# EAGLE design Adafruit PMSA003I (EAGLE 9.6.2)
COMPANY: ADAFRUIT INDUSTRIES; DRAWN: KTOWN; REV: A
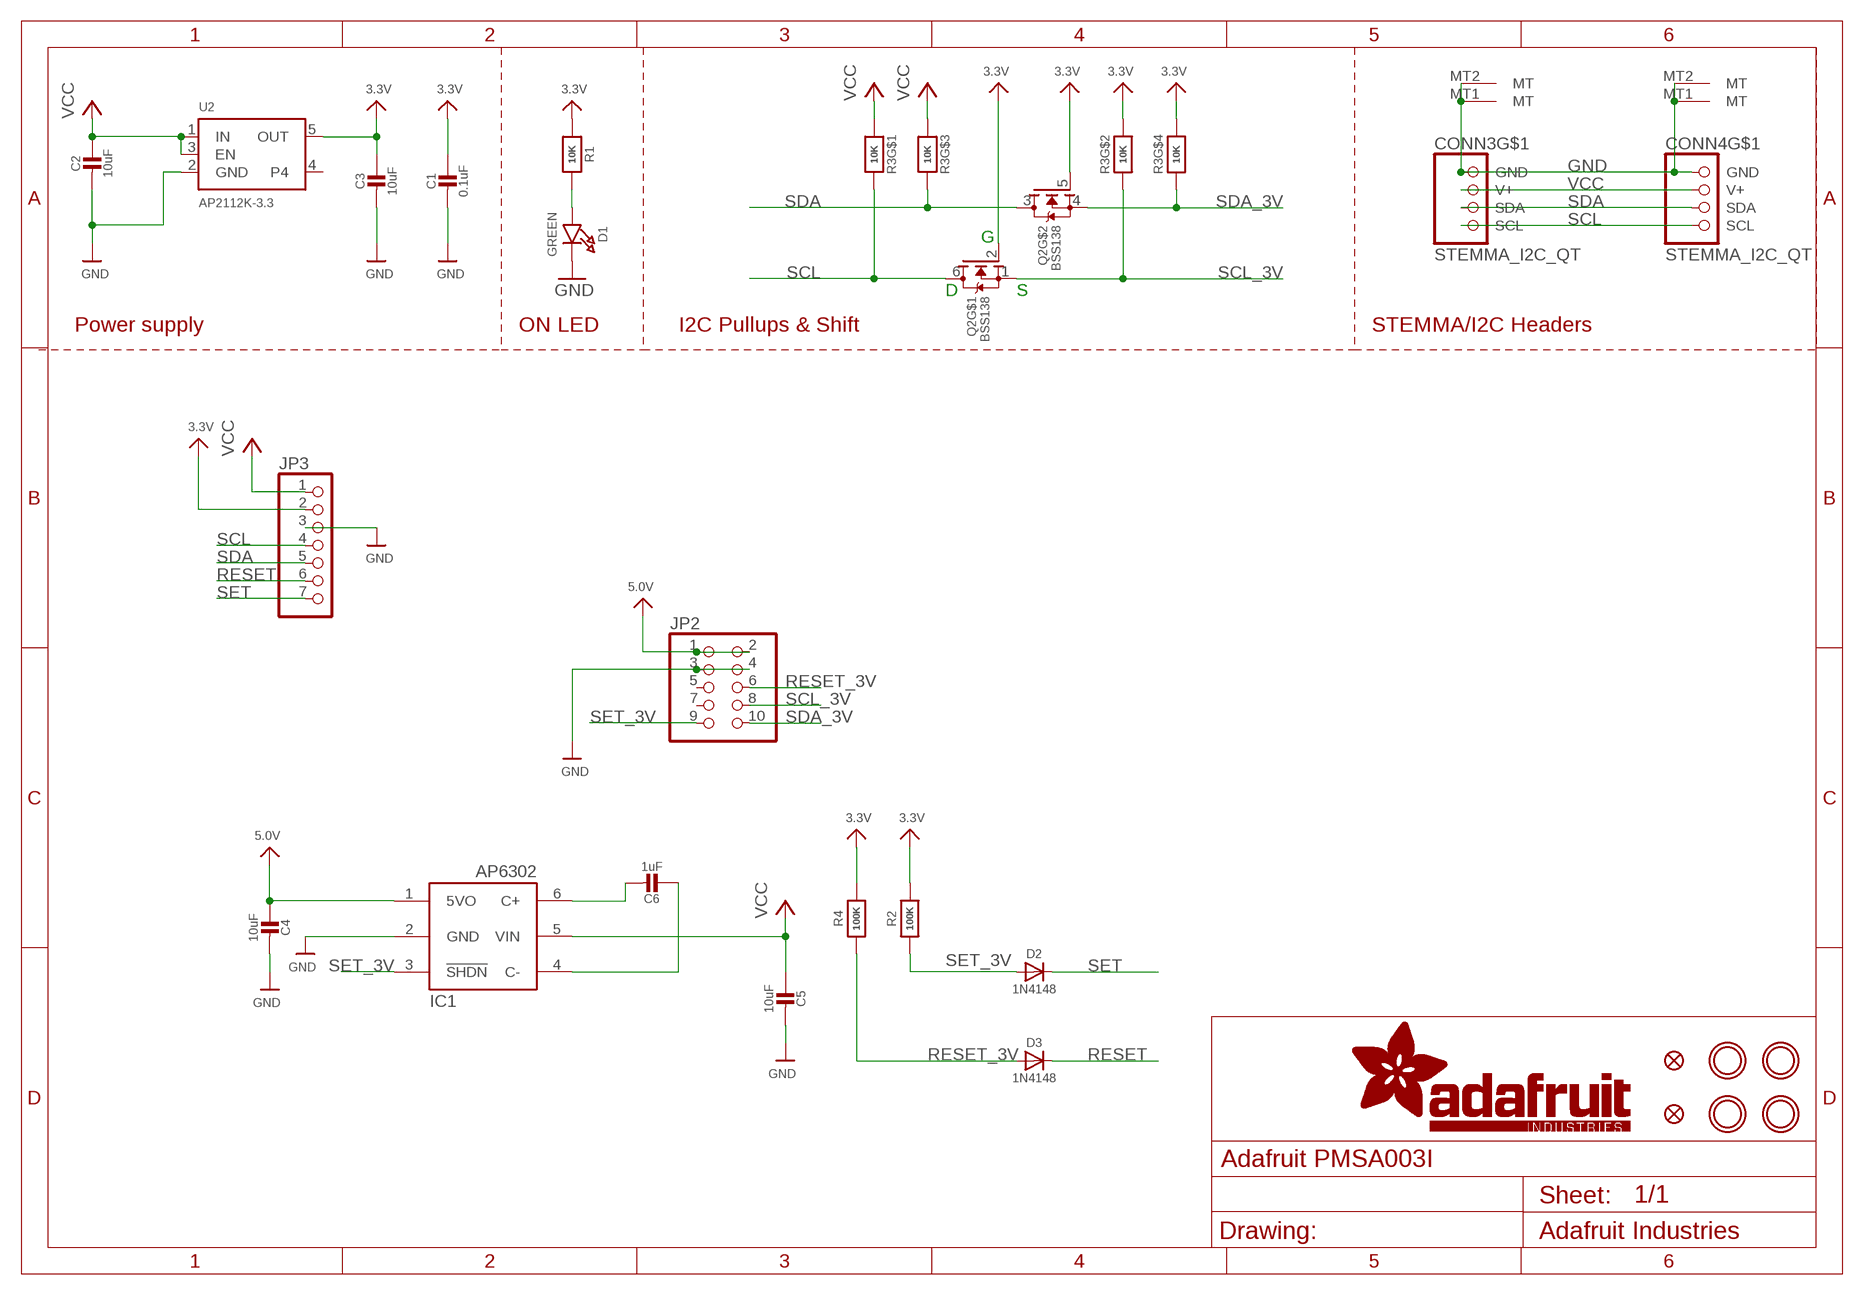
[diagram p0: schematic, sheet 1]

## Parts
C1  0.1uF  CAP_CERAMIC0603_NO  [0603-NO]
C2  10uF  CAP_CERAMIC0805-NOOUTLINE  [0805-NO]
C3  10uF  CAP_CERAMIC0805-NOOUTLINE  [0805-NO]
C4  10uF  CAP_CERAMIC0805-NOOUTLINE  [0805-NO]
C5  10uF  CAP_CERAMIC0805_10MGAP  [0805_10MGAP]
C6  1uF  CAP_CERAMIC0805-NOOUTLINE  [0805-NO]
CONN3  STEMMA_I2C_QT  [JST_SH4]
CONN4  STEMMA_I2C_QT  [JST_SH4]
D1  GREEN  LED0603_NOOUTLINE  [CHIPLED_0603_NOOUTLINE]
D2  1N4148  DIODESOD-323  [SOD-323]
D3  1N4148  DIODESOD-323  [SOD-323]
FID3  FIDUCIAL_1MM  [FIDUCIAL_1MM]
FID4  FIDUCIAL_1MM  [FIDUCIAL_1MM]
IC1  AP3602/RT9361  AP3602  [SOT23-6]
JP2  HEADER-2X51.27MM  [2X05_1.27MM_SMT]
JP3  HEADER-1X770MIL  [1X07_ROUND_70]
Q2  BSS138  MOSFET-N_DUAL  [SOT363]
R1  10K  RESISTOR_0603_NOOUT  [0603-NO]
R2  100K  RESISTOR_0603_NOOUT  [0603-NO]
R3  10K  RESISTOR_4PACK  [RESPACK_4X0603]
R4  100K  RESISTOR_0603_NOOUT  [0603-NO]
U2  AP2112K-3.3  VREG_SOT23-5  [SOT23-5]
U$1  MOUNTINGHOLE2.5  [MOUNTINGHOLE_2.5_PLATED]
U$17  MOUNTINGHOLE2.5  [MOUNTINGHOLE_2.5_PLATED]
U$19  MOUNTINGHOLE2.5  [MOUNTINGHOLE_2.5_PLATED]
U$21  MOUNTINGHOLE2.5  [MOUNTINGHOLE_2.5_PLATED]

## Nets
3.3V [lowpower]: C1.1 C3.1 JP3.2 Q2.2(G) Q2.5(G) R1.1 R2.1 R3.2 R3.4 R4.1 U2.5(OUT)
5.0V: C4.1 IC1.1(5VO) JP2.1 JP2.2
GND [highpower]: C1.2 C2.2 C3.2 C4.2 C5.2 CONN3.1(GND) CONN3.MT1(MT) CONN3.MT2(MT) CONN4.1(GND) CONN4.MT1(MT) CONN4.MT2(MT) D1.C IC1.2(GND) JP2.3 JP2.4 JP3.3 U2.2(GND)
N$1: D1.A R1.2
N$2: C6.2 IC1.6(C+)
N$3: C6.1 IC1.4(C-)
RESET: D3.C JP3.6
RESET_3V: D3.A JP2.6 R4.2
SCL: CONN3.4(SCL) CONN4.4(SCL) JP3.4 Q2.6(D) R3.8
SCL_3V: JP2.8 Q2.1(S) R3.7
SDA: CONN3.3(SDA) CONN4.3(SDA) JP3.5 Q2.3(D) R3.6
SDA_3V: JP2.10 Q2.4(S) R3.5
SET: D2.C JP3.7
SET_3V: D2.A IC1.3(!SHDN) JP2.9 R2.2
VCC [highpower]: C2.1 C5.1 CONN3.2(V+) CONN4.2(V+) IC1.5(VIN) JP3.1 R3.1 R3.3 U2.1(IN) U2.3(EN)
Unconnected: JP2.5 JP2.7 U2.4

## Notes on the sheet
- G
- D | S
- Power supply | ON LED | I2C Pullups & Shift | STEMMA/I2C Headers

## Library data of the parts
C1-C6 = microbuilder:CAP_CERAMIC: Ceramic Capacitors For new designs, use the packages preceded by an '_' character since they are more reliable: The following footprints should be used on most boards: _0402 - Standard footprint for regular board layouts _0603 - Standard footprint for regular board layouts _0805 - Standard footprint for regular board layouts _1206 - Standard footprint for regular board layouts For extremely tight-pitch boards where space is at a premium, the following 'micro-pitch' footprints can be used (smaller pads, no silkscreen outline, etc.): _0402MP - Micro-pitch footprint for very dense/compact boards _0603MP - Micro-pitch footprint for very dense/compact boards _0805MP - Micro-pitch footprint for very dense/compact boards _1206MP - Micro-pitch footprint for very dense/compact boards
CONN3 CONN4 = microbuilder:STEMMA_I2C
D1 = microbuilder:LED: LED 0603 - 0603 Surface Mount Package 2mA: Green LED - Low Power (3.9mcd, 2ma, 1.7Vf) - Digikey: 475-2709-2-ND Orange LED - Low Power (9.8mcd, 2ma, 1.8Vf) - Digikey: 475-1194-2-ND Red LED - Low Power (5mcd, 2ma, 1.8Vf) - Digikey: 475-1195-2-ND Yellow LED - Low Power (7mcd, 2ma, 1.8Vf) - Digikey: 475-1196-2-ND 5mA: Blue LED - Low Power (17mcd, 5ma, 2.9Vf) - Digikey: LNJ937W8CRACT-ND 0805 - 0805 Surface Mount Package 2mA: Red LED (8.8mcd, 2mA, 1.8Vf, Clear) - Low Power [Digikey: 475-2510-1-ND] Green LED (5mcd, 2mA, 1.8Vf, Clear) - Low Power [Digikey: 475-2730-1-ND] Yellow LED (11.3mcd, 2mA, 1.8Vf, Clear) - Low Power [Digikey: 475-2555-1-ND] 20mA: Red LED (104mcd, 20mA, Diffused) - LS R976 [Digikey: 475-1278-6-ND] Red LED (12mcd, 20mA, 2.0Vf, Clear) - APT2012EC [Digikey: 754-1128-1-ND] Green LED (15mcd, 20mA, 2.2Vf, Clear) - APT2012GC [Digikey: 754-1131-1-ND] Orange LED (160mcd, 20mA, 2.1Vf, Clear) - APT2012SECK [Digikey: 754-1130-1-ND] 1206 - 1206 Surface Mount Package Green LED (26mcd, 20mA, Diffused) - LG N971 [Digikey: 475-1407-6-ND] Red LED (15mcd, 20mA, Diffused) - LH N974 [Digikey: 475-1416-6-ND] Cree - Cree High-Power Surface Mount LEDs XPEBWT-L1-0000-00D50 - White 111lm 350mA 2.9Vf 6200K 110° XTEAWT-00-0000-00000LEE3 - White 114lm 350mA 2.85Vf 5000K 115° Everlight - Everlight 45-21 Series Surface Mount LEDs 45-21/QK2C-B2832AC2CB2/2T - Warm White 2000mcd 20mA 3.25Vf 3050K 120° 45-21/LK2C-B38452C4CB2/2T - Nuetral White 2000mcd 20mA 3.25Vf 4150K 120° 45-21/LK2C-B50634C6CB2/2T - Cold White 2200mcd 20mA 3.25Vf 5650K 120° PLCC2 Reverse Mount LS T77K-J1L2-1-0-2-R18-Z - Red 11.25mcd 2mA 1.8Vf 630nm 120° LO T77K-L1M2-24-Z - Orange 19.6mcd 2mA 1.8Vf 606nm 120° LY T77K-K2M1-26-Z - Yellow 15.7mcd 2mA 1.8Vf 587nm 120°
D2 D3 = microbuilder:DIODE: Diode SMA Model Volts Amps Type Vf Ir Digikey # Notes SSA34-E3 40V 3A Schottky 480mV @ 3A 200uA @ 40V SSA34-E3/61TGITR-ND CDBA120-G 20V 1A Schottky 500mV @ 1A 500uA @ 20V 641-1014-6-ND REEL MBRA210 10V 2A Schottky 350mV @ 2A 700uA @ 10V MBRA210LT3 SOD-123 Model Volts Amps Type Vf Ir Order # Notes BAT54T1G 30V 200mA Schottky 800mV @ 200mA 2uA @ 25V BAT54T1GOSTR-ND B0530W 30V 500mA Schottky 430mV @ 500mA 130uA @ 30V B0530W-FDICT-ND REEL MBR120 20V 1A Schottky 340mV @ 1A MBR120VLSFT1GOSCT-ND SOD-323 Model Volts Amps Type Vf Ir Order # Notes PMEG2005EJ 20V 500mA Schottky 355mV @ 500mA 568-4110-1-ND ZLLS410 10V 570mA Schottky 380mV @ 570mA ZLLS410CT-ND 1N4148WS 75V 150mA Silicon/Simple 1V 1N4148WSFSCT-ND REEL SOD-523 Model Volts Amps Type Vf Ir Order # Notes BAT54XV2 30V 200mA Schottky 0.8V @ 100mA BAT54XV2CT-ND TB751S 30V 30mA Schottky RB751S-40TE61CT-ND SOT23-R/W (R = Solder Paste/Reflow Ovens, W = Hand-Soldering) Model Volts Amps Type Vf Ir Order # Notes BAT54FILM 40V 300mA Schottky 497-7162-1-ND POWERDI-5 Model Volts Amps Type Vf Ir Order # Notes PDS560 60V 5A Schottky 670mV @ 5A 150uA @ 60V PDS560DICT-ND
FID3 FID4 = microbuilder:FIDUCIAL: Fiducial Alignment Points Various fiducial points for machine vision alignment.; BOM: EXCLUDE
IC1 = microbuilder:AP3602
JP2 = microbuilder:HEADER-2X5: PIN HEADER
JP3 = microbuilder:HEADER-1X7: PIN HEADER
Q2 = microbuilder:MOSFET-N_DUAL: Dual N-Channel MOSFET SOT363 (2.0x1.25mm) 2N7002PS - 60V, 320mA [Digikey: 568-5984-1-ND]
R1 R2 R4 = microbuilder:RESISTOR: Resistors For new designs, use the packages preceded by an '_' character since they are more reliable: The following footprints should be used on most boards: _0402 - Standard footprint for regular board layouts _0603 - Standard footprint for regular board layouts _0805 - Standard footprint for regular board layouts _1206 - Standard footprint for regular board layouts For extremely tight-pitch boards where space is at a premium, the following 'micro-pitch' footprints can be used (smaller pads, no silkscreen outline, etc.): _0402MP - Micro-pitch footprint for very dense/compact boards _0603MP - Micro-pitch footprint for very dense/compact boards _0805MP - Micro-pitch footprint for very dense/compact boards _1206MP - Micro-pitch footprint for very dense/compact boards
R3 = microbuilder:RESISTOR_4PACK: Resistor Packs (4 resistors) 4 x 0603 10K 1/16W - Digikey: YC164J-10KCT-ND
U2 = microbuilder:VREG_SOT23-5: SOT23-5 Fixed Voltage Regulators Part Current Out V Out V In V Dropout θJA (°C/W) TJ (°C) Digikey Part No. ADP121 150mA 3.3V 3.4-5.5V 0.09V @ 150mA -- -- ADP121-AUJZ33R7CT-ND ADP121 150mA 3.0V 3.1-5.5V 0.09V @ 150mA -- -- ADP121-AUJZ30R7CT-ND ADP122 300mA 3.3V 3.4-5.5V 0.085V @ 300mA -- -- ADP122AUJZ-3.3-R7CT-ND ADP1712 300mA 3.3V 3.5-5.5V 0.17V @ 300mA -- -- ADP1712AUJZ-3.3-R7TR-ND AP7311 (Low Cost) 150mA 3.3V 3.5-6V 0.15V @ 150mA -- -- AP7311-33WG-7DICT-ND LD39015M18R 150mA 1.8V 1.9V-5.5V 0.08V @ 100mA -- -- 497-6977-1-ND LP2985A-33DBVR 150mA 3.3V 3.3-16V 0.28V @ 150mA 206 150 296-18479-1-ND MCP1824T-3302E/OT 300mA 3.3V 3.5V-6V 0.2V @ 300mA -- -- MCP1824T-3302E/OTCT-ND MIC5205-2.5YM5 TR 150mA 2.5V 2.7-16V 0.165V @ 150mA -- -- 576-1257-2-ND MIC5205-3.0YM5 TR 150mA 3.0V 3.2V-16V 0.165V @ 150mA -- -- 576-1258-2-ND MIC5205-3.3YM5 TR 150mA 3.3V 3.5V-16V 0.165V @ 150mA -- -- 576-1259-2-ND TPS780330220 150mA 3.3V+2.2V 3.6-5.5V 250mV Max -- -- 296-23332-1-ND TDA3663/N1,135 100mA 3.3V 3.5-45V 0.18V @ 50mA -- -- 568-5343-1-ND Max operating temp can be calculated using θJA, TJ (max junction temperature), and power in watts. Set the "Maximum Ambient Temperature" until it reaches TJ ("Max Junction Temperature"), which is the absolute limit for safe use of the regulator: Heat Sink Temperature Calculator <http://www.daycounter.com/Calculators/Heat-Sink-Temperature-Calculator.phtml> For example, With 12V source into a 3.3V LP2985 and a 30mA load, we are dissipating (12V-3.3V) * 0.03A = 0.261W. With a θJA of 206 °C/W, a TJ of 150°C, and 261mW we can safely use the chip without a heat sink up to 75°C (=147.1°C Junction Temperature).
U$1 U$17 U$19 U$21 = microbuilder:MOUNTINGHOLE: Mounting Hole For #2 screws (0.086"/2.18mm width, 0.094"/2.4mm hole) use 2.5mm; BOM: EXCLUDE

## Net classes
1 highpower: width 0.305 mm, drill 0.483 mm
2 lowpower: width 0.254 mm, drill 0.483 mm

## Board
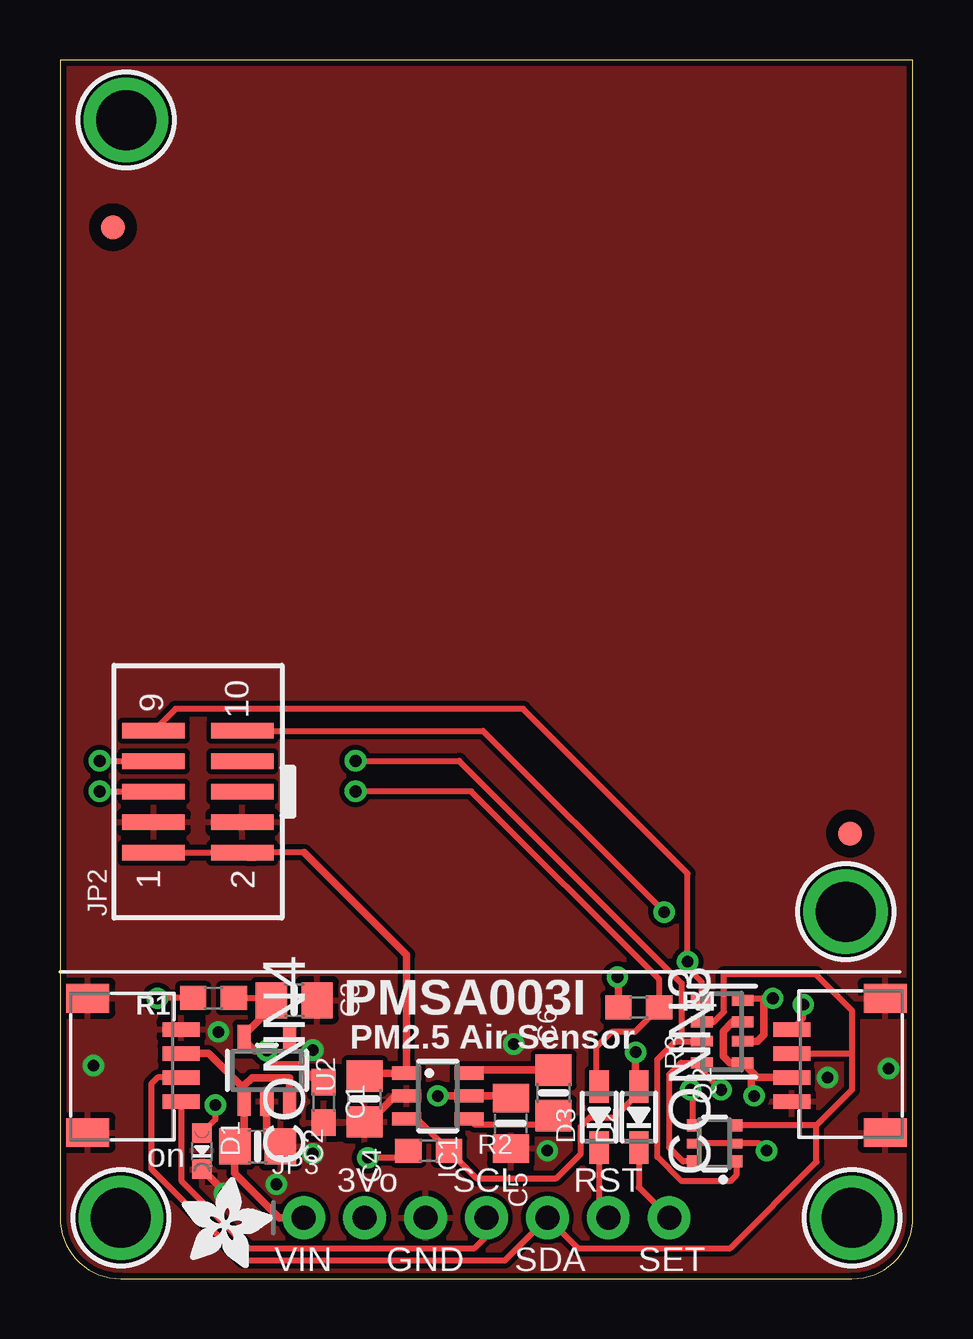
[diagram p1: board, top side]
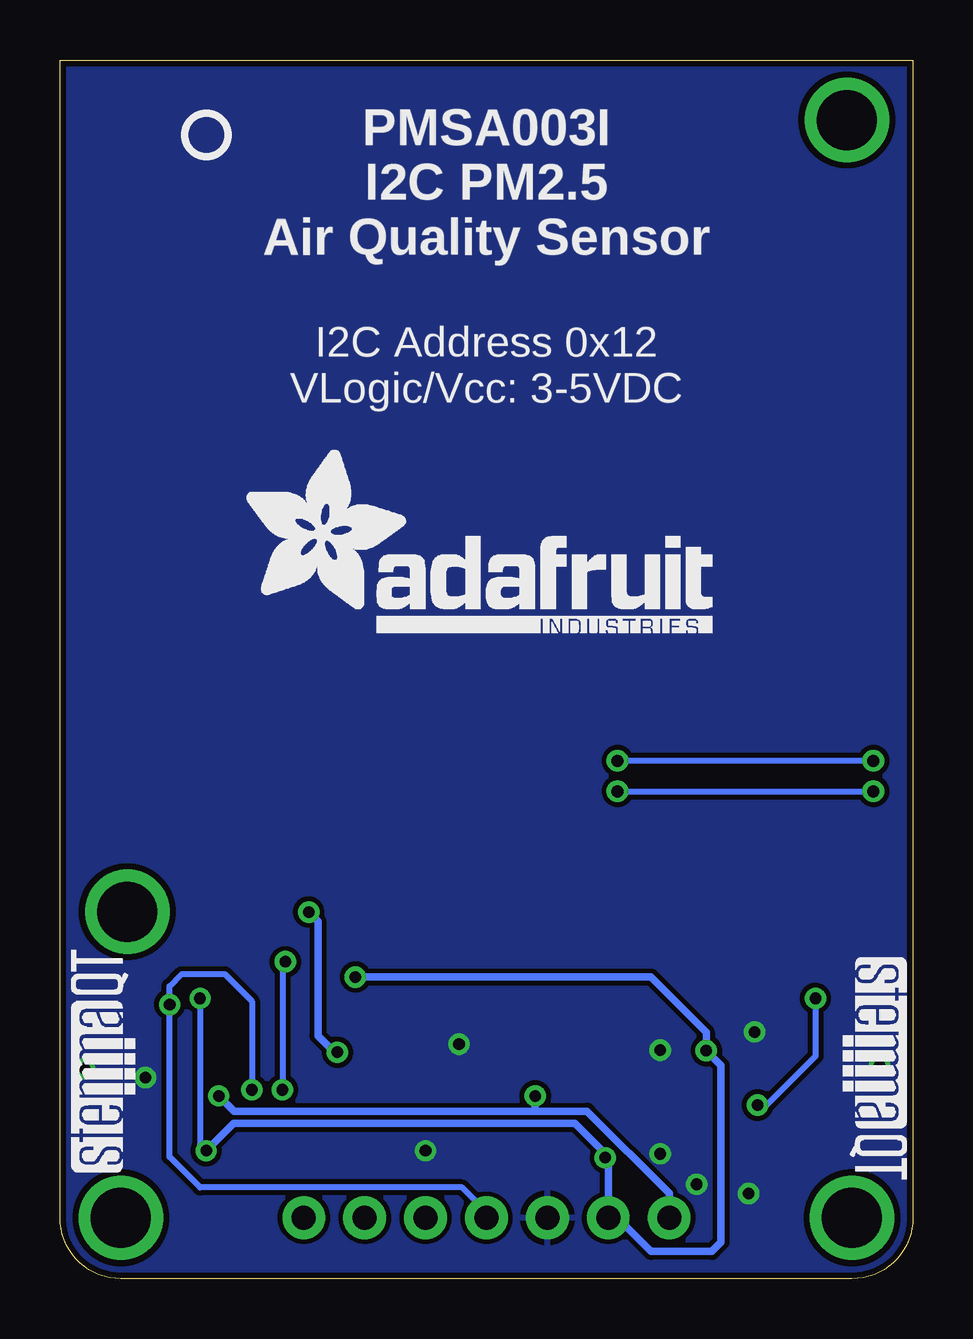
[diagram p2: board, bottom side, seen from below]

Size 35.56 x 50.8 mm. Coordinates in mm from the lower left corner, seen from the top.
Outline: 0,50.8 0,2.54 arc90 2.54,0 33.02,0 arc90 35.56,2.54 35.56,50.8 0,50.8
Copper layers (1*16): Top 0.035mm / dielectric 1.5mm / Bottom 0.035mm
Design rules "adafruit *": minimum track width 8mil, minimum drill 15.5mil, track to track 8mil, track to pad 8mil, pad to pad 8mil, via to via 8mil, smd to smd 8mil, copper to edge 10mil, drill to drill 8mil, minimum pad ring 10mil, minimum via ring 8mil, stop-mask expansion 2mil, vias tented up to drill 20mil, thermal gap 10mil

### Footprints (pad centres in the part's own frame; a part is rotated, then mirrored left to right if it is on the bottom)
0603-NO = smd 1.1 x 1: 1 -0.85,0; 2 0.85,0
0805-NO = smd 1.3 x 1.5: 1 -0.95,0; 2 0.95,0
0805_10MGAP = smd 1.2 x 1.5: 1 -1.05,0; 2 1.05,0
JST_SH4 = smd 0.6 x 1.55: 1 -1.5,2.514; 2 -0.5,2.514; 3 0.5,2.514; 4 1.5,2.514 | smd 1.2 x 1.8: MT1 -2.8,-1.386; MT2 2.8,-1.386
CHIPLED_0603_NOOUTLINE = smd 0.8 x 0.8: A 0,-0.75; C 0,0.75
SOD-323 = smd 1.35 x 0.8: A 1.27,0; C -1.27,0
FIDUCIAL_1MM = smd 1 x 1: 1 0,0
SOT23-6 = smd 0.55 x 1.2: 1 -0.95,-1.3; 2 0,-1.3; 3 0.95,-1.3; 4 0.95,1.3; 5 0,1.3; 6 -0.95,1.3
2X05_1.27MM_SMT = smd 0.65 x 2.6: 1 -2.54,-1.85; 2 -2.54,1.85; 3 -1.27,-1.85; 4 -1.27,1.85; 5 0,-1.85; 6 0,1.85; 7 1.27,-1.85; 8 1.27,1.85; 9 2.54,-1.85; 10 2.54,1.85
1X07_ROUND_70 = drill 1 pad 1.778: 1 -7.62,0; 2 -5.08,0; 3 -2.54,0; 4 0,0; 5 2.54,0; 6 5.08,0; 7 7.62,0
SOT363 = smd 0.5 x 0.5: 1 -0.75,-0.9; 3 0.75,-0.9; 4 0.75,0.9; 6 -0.75,0.9 | smd 0.4 x 0.5: 2 0,-0.9; 5 0,0.9
RESPACK_4X0603 = smd 0.45 x 0.9: 1 -1.3,-0.85; 2 -0.4,-0.85; 3 0.4,-0.85; 4 1.3,-0.85; 5 1.3,0.85; 6 0.4,0.85; 7 -0.4,0.85; 8 -1.3,0.85
SOT23-5 = smd 0.55 x 1.2: 1 -0.95,-1.3; 2 0,-1.3; 3 0.95,-1.3; 4 0.95,1.3; 5 -0.95,1.3
MOUNTINGHOLE_2.5_PLATED = drill 2.5 pad 3.2: P$1 0,0

### Placement (x,y rotation side)
C1  11,7.35 270 top
C2  8.24,5.51 0 top
C3  9.77,11.61 0 top
C4  12.7,7.49 270 top
C5  18.8,6.48 270 top
C6  20.57,7.75 90 top
CONN3  33.02,8.89 90 top
CONN4  2.54,8.89 270 top
D1  5.92,5.32 180 top
D2  24.13,6.73 90 top
D3  22.48,6.73 90 top
FID3  32.94,18.56 270 top
FID4  2.21,43.83 270 top
IC1  15.75,7.62 270 top
JP2  5.75,20.3 90 top
JP3  17.78,2.54 0 top
Q2  27.29,5.64 90 top
R1  6.4,11.7 180 top
R2  15.37,5.33 0 top
R3  27.61,10.3 90 top
R4  24.13,11.3 0 top
U2  8.62,8.69 0 top
U$1  2.75,48.3 270 top
U$17  32.75,15.3 270 top
U$19  2.54,2.54 270 top
U$21  33.02,2.54 270 top
U$22  [ADAFRUIT_3.5MM]  5.07,0.43 0 top
U$25  [PCBFEAT-REV-040]  29.45,47.68 0 bottom
U$28  [ADAFRUIT_TEXT_20MM]  27.94,26.92 0 bottom
U$30  [STEMMAQT]  32.44,4.45 90 bottom
U$31  [STEMMAQT]  2.91,13.39 270 bottom

### Tracks (layer width: path | path; a pad name or v marks a point on that pad's centre or on a via)
3.3V  (via drill 0.48)
  Top 0.254: Q2.5 Q2.2 29.16,5.64 v29.46,5.33 | R3.4 28.46,11.57 28.57,11.68 29.34,11.68 v29.72,11.68 | R2.1 14.22,5.04 v12.83,5.04 | R1.1 8.72,11.7 C3.1
  Top 0.305: C1.1 11,8.38 10.54,8.38 10.02,8.9 8.9,8.9 8.62,9.18 v8.62,9.51 8.11,9.51 7.67,9.95 U2.5 7.67,10.16 8.81,11.3 C3.1 | R3.2 29.08,9.9 29.34,10.16 29.34,11.68 | R4.1 23.28,12.53 v23.24,12.57
  Bottom 0.254: v29.72,11.68 29.72,5.59 v29.46,5.33 | v12.83,5.04 12.83,5.08 12.76,5.14
  Bottom 0.305: v29.46,5.33 28.32,6.48 14.1,6.48 12.76,5.14 12.7,5.08 JP3.2 12.32,2.54 10.92,1.14 8.38,1.14 8,1.52 8,8.89 v8.62,9.51 | v23.24,12.57 10.92,12.57 8.62,10.27 v8.62,9.51 | v8.62,9.51
5.0V
  Top 0.254: JP2.2 JP2.1 | JP2.1 7.89,17.76 8.13,17.53 7.84,17.53 JP2.1 | 10.18,17.76 JP2.1
  Top 0.305: C4.1 12.83,8.57 IC1.1 14.45,13.49 10.18,17.76
GND  (via drill 0.48)
  Top 0.305: IC1.2 13.97,7.62 12.89,6.54 C4.2 | U2.2 8.62,6.08 C2.2 | D1.C 6.86,3.63 v6.86,3.56
  other vias: 6.6,10.29 10.54,9.53 32,8.38 20.32,5.33 1.4,8.89 9.02,3.94 18.92,9.78 34.54,8.76 10.54,5.21
  pour Top: 0,0 0,50.8 35.56,50.8 35.56,0
  pour Bottom: 0,0 0,50.8 35.56,50.8 35.56,0
N$1  (via drill 0.48)
  Top 0.254: R1.2 4.08,11.7 v4.06,11.68 | v6.48,7.24 6.48,6.63 D1.A
  Bottom 0.254: v4.06,11.68 4.06,9.27 6.1,7.24 v6.48,7.24
N$2
  Top 0.305: C6.2 17.18,8.7 IC1.6
N$3
  Top 0.254: C6.1 20.19,6.42 17.3,6.42 IC1.4
RESET
  Top 0.254: D3.C 22.48,2.92 JP3.6
RESET_3V  (via drill 0.5)
  Top 0.254: D3.A 22.35,8.13 22.35,9.65 22.99,10.29 23.96,10.29 R4.2 24.98,12.48 17.14,20.32 v12.32,20.32 | v1.65,20.32 3.88,20.32 JP2.6
  Bottom 0.254: v12.32,20.32 v1.65,20.32
SCL  (via drill 0.48)
  Top 0.254: CONN4.4 5.05,4.09 7.87,1.27 17.27,1.27 17.78,1.78 JP3.4 | Q2.6 25.97,4.89 25.4,5.46 25.4,8.51 25.89,9 R3.8 26.76,8.67 v27.56,7.87 | CONN3.4 30.99,10.87 v30.99,11.43
  Bottom 0.254: v27.56,7.87 27.56,11.56 28.7,12.7 30.48,12.7 30.99,12.19 v30.99,11.43 30.99,5.08 29.72,3.81 18.8,3.81 17.78,2.79 JP3.4
SCL_3V  (via drill 0.5)
  Top 0.254: 25.91,9.9 25.91,12.32 16.64,21.59 v12.32,21.59 | Q2.1 28.19,4.32 27.94,4.06 25.91,4.06 24.9,5.08 24.9,9.14 25.66,9.9 25.91,9.9 | 25.91,9.9 R3.7 | JP2.8 1.67,21.57 v1.65,21.59
  Bottom 0.254: v1.65,21.59 v12.32,21.59
SDA
  Top 0.254: CONN3.3 33.02,9.39 | 31.54,6.39 Q2.3 | 31.54,6.39 33.02,7.87 33.02,9.39 | 33.02,9.39 33.02,11.18 31.5,12.7 27.69,12.7 27.68,12.69 27.68,11.12 27.26,10.7 R3.6 | 31.54,6.39 31.54,4.87 27.94,1.27 21.59,1.27 JP3.5 18.54,0.76 7.62,0.76 3.81,4.57 3.81,8.13 4.07,8.39 CONN4.3
SDA_3V  (via drill 0.48)
  Top 0.254: R3.5 26.76,12.36 26.17,12.96 v26.17,13.21 26.17,16.89 19.3,23.75 4.81,23.75 JP2.10 | Q2.4 26.39,7.77 v26.29,7.87
  Bottom 0.254: v26.17,13.21 26.29,13.09 v26.29,7.87
SET
  Top 0.254: D2.C 24.13,3.81 JP3.7
SET_3V  (via drill 0.48)
  Top 0.254: IC1.3 14.88,6.67 R2.2 17.36,4.19 20.7,4.19 21.72,5.21 21.72,6.35 22.1,6.73 23.11,6.73 24.13,7.75 D2.A | JP2.9 17.63,22.84 v25.19,15.28
  Top 0.305: D2.A 24,8.14 v24,9.44
  Bottom 0.305: v25.19,15.28 24.81,14.9 24.81,10.12 24.12,9.44 v24,9.44
VCC  (via drill 0.48)
  Top 0.305: U2.3 9.57,8.38 8,8.38 7.67,8.05 U2.1 | 29.07,8.39 R3.1 27.93,9 27.65,9.28 27.65,10.32 28.04,10.7 R3.3 | CONN3.2 29.07,8.39 | 29.07,8.39 28.82,8.39 28.82,7.75 v28.94,7.62 | v15.75,7.62 IC1.5 18.7,7.62 C5.1 | CONN4.2 6.2,9.39 7.67,7.92 U2.1 | U2.1 7.67,5.89 C2.1 7.29,4.39 9.14,2.54 JP3.1
  Bottom 0.305: v28.94,7.62 28.31,6.99 15.75,6.99 | JP3.1 10.16,3.56 13.59,6.99 15.75,6.99 | v15.75,7.62 15.75,6.99

### Text on the board
tPlace: 9 | 10 | 1 | 2 | PMSA003I | PM2.5 Air Sensor | on | 3Vo | SCL | RST | VIN | GND | SDA | SET
bPlace: PMSA003I / I2C PM2.5 / Air Quality Sensor | I2C Address 0x12 / VLogic/Vcc: 3-5VDC